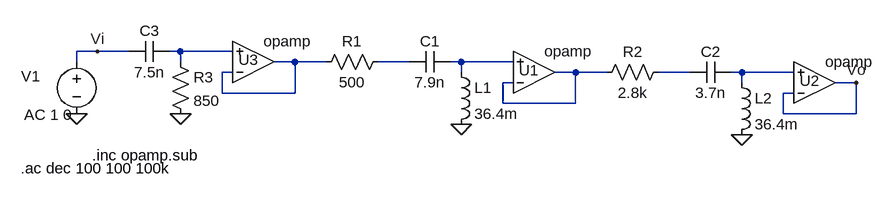
[diagram p0: schematic Ej_6a.asc]
Ej_6a.asc, the LTspice schematic file:
Version 4
SHEET 1 880 680
WIRE -368 112 -400 112
WIRE -320 112 -368 112
WIRE -240 112 -256 112
WIRE -160 112 -240 112
WIRE -400 128 -400 112
WIRE -240 128 -240 112
WIRE -64 128 -96 128
WIRE -16 128 -64 128
WIRE 112 128 64 128
WIRE 192 128 176 128
WIRE 272 128 192 128
WIRE -160 144 -176 144
WIRE 192 144 192 128
WIRE 368 144 336 144
WIRE 416 144 368 144
WIRE 544 144 496 144
WIRE 624 144 608 144
WIRE 704 144 624 144
WIRE 272 160 256 160
WIRE 624 160 624 144
WIRE 800 160 768 160
WIRE -176 176 -176 144
WIRE -64 176 -64 128
WIRE -64 176 -176 176
WIRE 704 176 688 176
WIRE 256 192 256 160
WIRE 368 192 368 144
WIRE 368 192 256 192
WIRE 688 208 688 176
WIRE 800 208 800 160
WIRE 800 208 688 208
FLAG 192 224 0
FLAG 624 240 0
FLAG -240 208 0
FLAG -368 112 Vi
FLAG 800 160 Vo
FLAG -400 208 0
SYMBOL res 80 112 R90
WINDOW 0 0 56 VBottom 2
WINDOW 3 32 56 VTop 2
SYMATTR InstName R1
SYMATTR Value 500
SYMBOL cap 176 112 R90
WINDOW 0 0 32 VBottom 2
WINDOW 3 32 32 VTop 2
SYMATTR InstName C1
SYMATTR Value 7.9n
SYMBOL ind 176 128 R0
SYMATTR InstName L1
SYMATTR Value 36.4m
SYMBOL OpAmps\\opamp 304 208 M180
WINDOW 0 -23 67 Left 2
SYMATTR InstName U1
SYMBOL res 512 128 R90
WINDOW 0 0 56 VBottom 2
WINDOW 3 32 56 VTop 2
SYMATTR InstName R2
SYMATTR Value 2.8k
SYMBOL cap 608 128 R90
WINDOW 0 0 32 VBottom 2
WINDOW 3 32 32 VTop 2
SYMATTR InstName C2
SYMATTR Value 3.7n
SYMBOL ind 608 144 R0
SYMATTR InstName L2
SYMATTR Value 36.4m
SYMBOL OpAmps\\opamp 736 224 M180
WINDOW 0 -23 67 Left 2
SYMATTR InstName U2
SYMBOL cap -256 96 R90
WINDOW 0 0 32 VBottom 2
WINDOW 3 32 32 VTop 2
SYMATTR InstName C3
SYMATTR Value 7.5n
SYMBOL OpAmps\\opamp -128 192 M180
WINDOW 0 -23 67 Left 2
SYMATTR InstName U3
SYMBOL res -256 112 R0
SYMATTR InstName R3
SYMATTR Value 850
SYMBOL voltage -400 112 R0
WINDOW 0 -85 38 Left 2
WINDOW 3 -81 69 Left 2
WINDOW 123 -81 97 Left 2
WINDOW 39 0 0 Left 0
SYMATTR InstName V1
SYMATTR Value ""
SYMATTR Value2 AC 1 0
TEXT -376 272 Left 2 !.inc opamp.sub
TEXT -486 292 Left 2 !.ac dec 100 100 100k

The netlist it stands for:
* Ej_6a.asc
R1 N003 N002 500
C1 N004 N003 7.9n
L1 N004 0 36.4m
XU1 N005 N004 N005 opamp Aol=100K GBW=10Meg  ; pins invin noninvin out
R2 N006 N005 2.8k
C2 N007 N006 3.7n
L2 N007 0 36.4m
XU2 Vo N007 Vo opamp Aol=100K GBW=10Meg  ; pins invin noninvin out
C3 N001 Vi 7.5n
XU3 N002 N001 N002 opamp Aol=100K GBW=10Meg  ; pins invin noninvin out
R3 N001 0 850
V1 Vi 0 AC 1 0
.inc opamp.sub
.ac dec 100 100 100k
.backanno
.end